# Altium schematic sheet Power Section.SchDoc
size A3; SheetNumber: 6; SheetTotal: 12
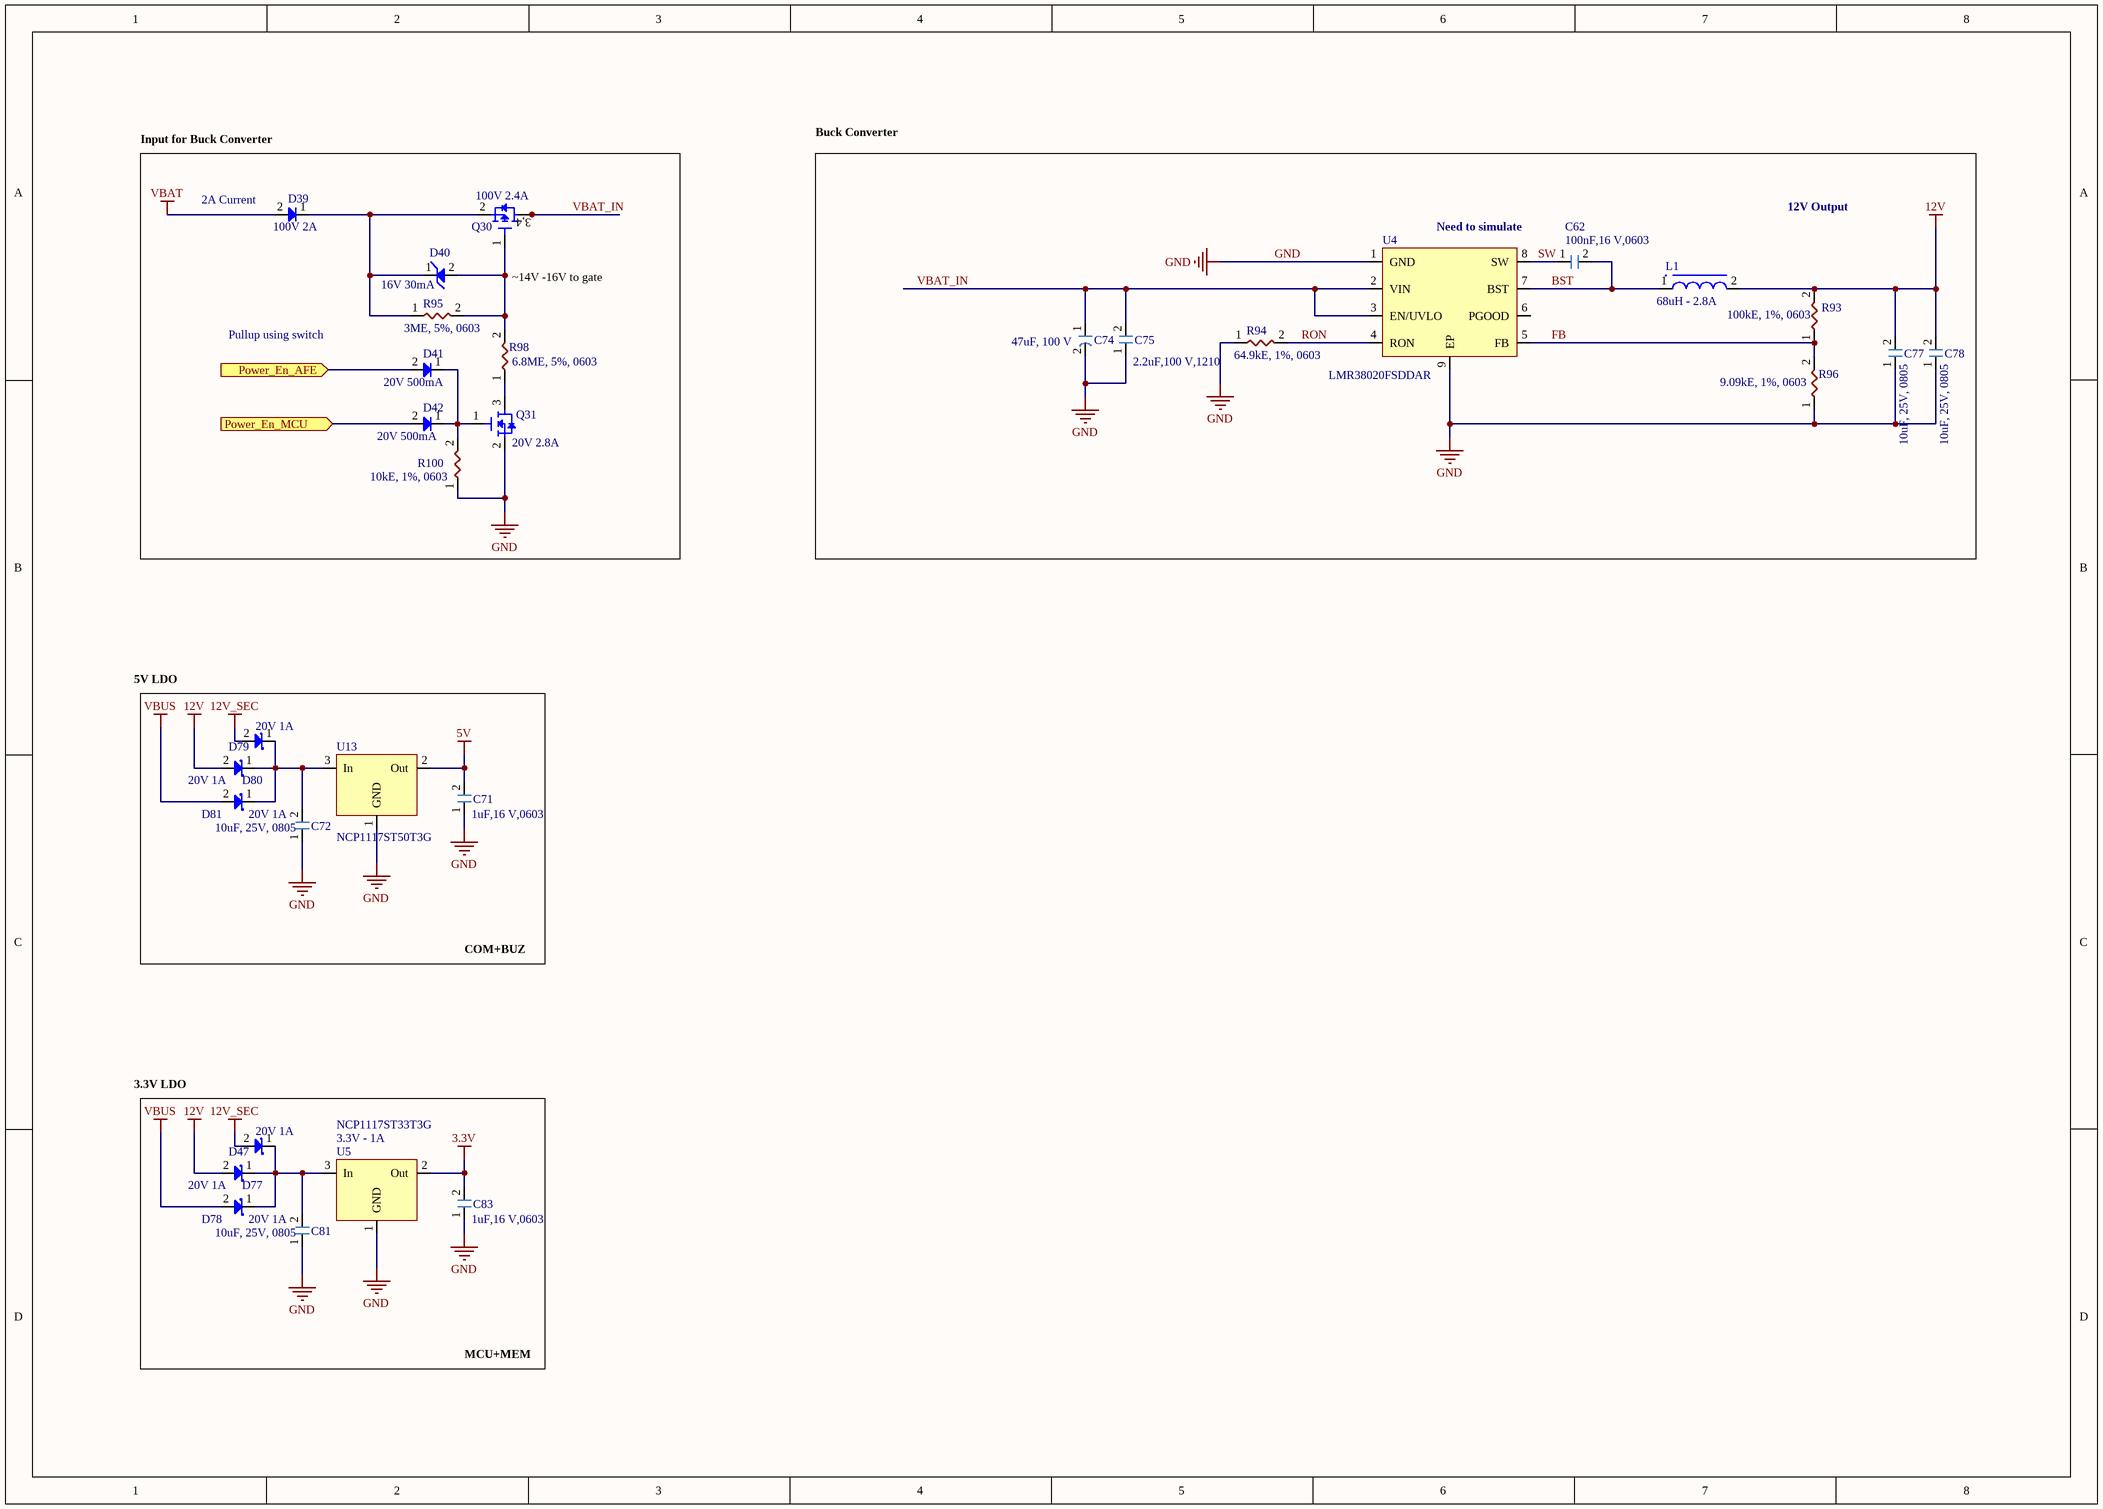
[diagram p0: Power Section.SchDoc]

## Parts
C62  Value Display: 100nF,16 V,0603  [CAPC1608X05N 0603]  (hidden comment: CC0603KRX7R7BB104)
C71  Value Display: 1uF,16 V,0603  [CAPC1608X05N 0603]  (hidden comment: CGA3E1X7R1C105K080AC)
C72  Value Display: 10uF, 25V, 0805  [CAPC2012X13N 0805]  (hidden comment: GRM21BZ71E106KE15L)
C74  Value Display: 47uF, 100 V  [Aluminium Electrolytic Capacitor]  (hidden comment: ESW476M100AH2AA)
C75  Value Display: 2.2uF,100 V,1210  [CAPC3225X28N 1210]  (hidden comment: HMK325B7225KMHT)
C77  Value Display: 10uF, 25V, 0805  [CAPC2012X13N 0805]  (hidden comment: GRM21BZ71E106KE15L)
C78  Value Display: 10uF, 25V, 0805  [CAPC2012X13N 0805]  (hidden comment: GRM21BZ71E106KE15L)
C81  Value Display: 10uF, 25V, 0805  [CAPC2012X13N 0805]  (hidden comment: GRM21BZ71E106KE15L)
C83  Value Display: 1uF,16 V,0603  [CAPC1608X05N 0603]  (hidden comment: CGA3E1X7R1C105K080AC)
D39  Value Display: 100V 2A  [SODFL350X110-2N]  (hidden comment: STPS2H100ZFY)
D40  Value Display: 16V 30mA  [DIODE_SOD123]  (hidden comment: MMSZ5246BQ-7-F)
D41  Value Display: 20V 500mA  [DIODE_SOD123]  (hidden comment: SBR80520LT1G)
D42  Value Display: 20V 500mA  [DIODE_SOD123]  (hidden comment: SBR80520LT1G)
D47  Value Display: 20V 1A  [SODFL360X98-2N]  (hidden comment: MBR120LSFT3G)
D77  Value Display: 20V 1A  [SODFL360X98-2N]  (hidden comment: MBR120LSFT3G)
D78  Value Display: 20V 1A  [SODFL360X98-2N]  (hidden comment: MBR120LSFT3G)
D79  Value Display: 20V 1A  [SODFL360X98-2N]  (hidden comment: MBR120LSFT3G)
D80  Value Display: 20V 1A  [SODFL360X98-2N]  (hidden comment: MBR120LSFT3G)
D81  Value Display: 20V 1A  [SODFL360X98-2N]  (hidden comment: MBR120LSFT3G)
L1  Value Display: 68uH - 2.8A  [INDP120120X102N]  (hidden comment: MSS1210-683ME)
Q30  Value Display: 100V 2.4A  [SOT230P700X180-4N]  (hidden comment: ZXMP10A17GQTA)
Q31  Value Display: 20V 2.8A  [SOT95P255X140-3N]  (hidden comment: DMG2302UK-7)
R93  Value Display: 100kE, 1%, 0603  [RESC1608X05N 0603]  (hidden comment: CRCW0805100KFKEA)
R94  Value Display: 64.9kE, 1%, 0603  [RESC1608X05N 0603]  (hidden comment: AC0603FR-0764K9L)
R95  Value Display: 3ME, 5%, 0603  [RESC1608X05N 0603]  (hidden comment: CRCW06033M00JNEA)
R96  Value Display: 9.09kE, 1%, 0603  [RESC1608X05N 0603]  (hidden comment: AC0603FR-079K09L)
R98  Value Display: 6.8ME, 5%, 0603  [RESC1608X05N 0603]  (hidden comment: CRCW06036M80JNEA)
R100  Value Display: 10kE, 1%, 0603  [RESC1608X05N 0603]  (hidden comment: CRCW060310K0FKEA)
U4  LMR38020FSDDAR  [SOIC127P600X170_HS-9N LM5164]
U5  NCP1117ST33T3G  Value Display: 3.3V - 1A  [SOT230P700X180-4N - NCP]
U13  NCP1117ST50T3G  [SOT230P700X180-4N - NCP]

## Blocks framed on the sheet
COM+BUZ: C71 C72 D79-D81 U13
MCU+MEM: C81 C83 D47 D77 D78 U5

## Ports
Power_En_AFE (in), Power_En_MCU (in)

## Nets
3.3V: C83.2 U5.2(Out)
5V: C71.2 U13.2(Out)
12V: C77.2 C78.2 D77.2(Anode) D80.2(Anode) L1.2 R93.2
12V_SEC: D47.2(Anode) D79.2(Anode)
GND: C71.1 C72.1 C74.2 C75.1 C77.1 C78.1 C81.1 C83.1 Q31.2(Source) R94.1 R96.1 R100.1 U4.1(GND) U4.9(EP) U5.1(GND) U13.1(GND)
VBAT: D39.2(Anode)
VBUS: D78.2(Anode) D81.2(Anode)
BST: C62.2 L1.1 U4.7(BST)
FB: R93.1 R96.2 U4.5(FB)
Power_En_AFE: D41.2(Anode) ; port Power_En_AFE
Power_En_MCU: D42.2(Anode) ; port Power_En_MCU
RON: R94.2 U4.4(RON)
SW: C62.1 U4.8(SW)
VBAT_IN: C74.1 C75.2 Q30.3(Drain) Q30.4(Drain) U4.2(VIN) U4.3(EN/UVLO)
NetC72_2: C72.2 D79.1(Cathode) D80.1(Cathode) D81.1(Cathode) U13.3(In)
NetC81_2: C81.2 D47.1(Cathode) D77.1(Cathode) D78.1(Cathode) U5.3(In)
NetD39_1: D39.1(Cathode) D40.1(Cathode) Q30.2(Source) R95.1
NetD40_2: D40.2(Anode) Q30.1(Gate) R95.2 R98.2
NetD41_1: D41.1(Cathode) D42.1(Cathode) Q31.1(Gate) R100.2
NetQ31_3: Q31.3(Drain) R98.1

Not connected (* = marked no-connect by the designer): U4 6(PGOOD)

## Notes on the sheet
- Input for Buck Converter
- Buck Converter
- (near D39) 2A Current
- (near U4) Need to simulate
- 12V Output
- (near Q30) ~14V -16V to gate
- Pullup using switch
- 5V LDO
- 3.3V LDO
- (in symbol FET_ZXMP10A17GQTA) 3,4

## Library data of the parts
C62 = Cap_CC0603KRX7R7BB104: Multilayer Ceramic Capacitor, 100 nF, 16V, ±10%,  X7R 0603 [1608 Metric]; Manufacturer: Yageo; Value: 100nF; Max Temp: 125 degC; Min Temp: -55 degC; Polarized: No; AEC-Q: NA; Manufacturer Part Number: CC0603KRX7R7BB104; Category: Capacitor; ComponentLink1Description: Datasheet; Mount Type: Surface Mount; Package: 0603; RoHS: Yes; Supplier 1: Digikey; Supplier 1 Part Number: 311-1088-1-ND; Supplier 1 pricing per Unit: 8.34 INR; Supplier: Mouser; Supplier Part Number: 603-CC603KRX7R7BB104; Supplier pricing per Unit: 8.34 INR; Technology: Ceramic; Temp Coefficient: X7R; Tolerance: 10%; Value 1: CC0603KRX7R7BB104; Voltage: 16V; ComponentLink1URL: https://www.yageo.com/upload/media/product/productsearch/datasheet/mlcc/UPY-GPHC_X7R_6.3V-to-250V_24.pdf
C71 C83 = Cap_CGA3E1X7R1C105K080AC: Multilayer Ceramic Capacitor, 1uF, 16V, ±10%,  X7R 0603 [1608 Metric]; Manufacturer: TDK Corporation; Polarized: No; AEC-Q: 200; Min Temp: -55 degC; Max Temp: 125 degC; Value: 1 uF; Manufacturer Part Number: CGA3E1X7R1C105K080AC; Package: 0603; RoHS: Yes; Mount Type: Surface Mount; Supplier 1: Digikey; Voltage: 16V; Tolerance: 10%; Technology: Ceramic; Value 1: CGA3E1X7R1C105K080AC; Category: Capacitor; ComponentLink1Description: Datasheet; ComponentLink1URL: https://product.tdk.com/system/files/dam/doc/product/capacitor/ceramic/mlcc/catalog/mlcc_automotive_general_en.pdf; Supplier 1 Part Number: 445-12539-1-ND; Supplier 1 pricing per Unit: 10.84 INR; Supplier: Mouser; Supplier Part Number: 810-CGA3E1X7R1C105AC; Supplier pricing per Unit: 10.01 INR; Temp Coefficient: X7R
C72 C77 C78 C81 = Cap_GRM21BZ71E106KE15L: Multilayer Ceramic Capacitor, 10 uF, 25V, ±10%,  X7R 0805 (2012 Metric); Manufacturer: Murata; AEC-Q: NA; Max Temp: 125 degC; Min Temp: -55 degC; Polarized: No; Value: 10 uF; Category: Capacitor; ComponentLink1Description: Datasheet; ComponentLink1URL: https://search.murata.co.jp/Ceramy/image/img/A01X/G101/ENG/GRM21BZ71E106KE15-01.pdf; Manufacturer Part Number: GRM21BZ71E106KE15L; Mount Type: Surface Mount; Package: 0805; RoHS: Yes; Supplier 1: Digikey; Supplier 1 Part Number: 490-GRM21BZ71E106KE15LCT-ND; Supplier 1 pricing per Unit: 28.51 INR; Supplier: Mouser; Supplier Part Number: 81-GRM21BZ71E106KE5L; Supplier pricing per Unit: 30.02 INR; Technology: Ceramic; Temp Coefficient: X7R; Tolerance: 10%; Value 1: GRM21BZ71E106KE15L; Voltage: 25V
C74 = Cap_ESW476M100AH2AA: Aluminum Electrolytic Capacitors Radial, 47 µF 100 V, Can 370mOhm @ 100kHz 5000 Hrs @ 105°C; Manufacturer: KEMET; AEC-Q: NA; Max Temp: 105 degC; Min Temp: -40 degC; Pitch: 5 mm; Polarized: Yes; Temp Coefficient: Electrolyte; Tolerance: 20%; Value: 47uF; Voltage: 100V; Manufacturer Part Number: ESW476M100AH2AA; Category: Capacitor; ComponentLink1Description: Datasheet; ComponentLink1URL: https://www.mouser.in/datasheet/2/447/KEM_A4009_ESW-3316312.pdf; Mount Type: TH; Package: TH; RoHS: Yes; Supplier 1: Digikey; Supplier 1 Part Number: 399-6631-ND; Supplier 1 pricing per Unit: 35.85 INR; Supplier: Mouser; Supplier Part Number: 80-ESW476M100AH2AA; Supplier pricing per Unit: 35.86 INR; Technology: Electrolyte; Value 1: ESW476M100AH2AA
C75 = Cap_HMK325B7225KMHT: Multilayer Ceramic Capacitor, 2.2 uF, 100 V, ± 10%, X7R, 1210 [3225 Metric]; Manufacturer: Taiyo Yuden; AEC-Q: 200; Max Temp: 125 degC; Min Temp: -55 degC; Polarized: No; Value: 2.2uF; Voltage: 100V; Manufacturer Part Number: HMK325B7225KMHT; Category: Capacitor; ComponentLink1Description: Datasheet; ComponentLink1URL: https://ds.yuden.co.jp/TYCOMPAS/ut/detail?pn=HMK325B7225KMHT%20%20&u=M; Mount Type: Surface Mount; Package: 1210; RoHS: Yes; Supplier 1: Digikey; Supplier 1 Part Number: 587-6142-1-ND; Supplier 1 pricing per Unit: 33.35 INR; Supplier: Mouser; Supplier Part Number: 963-HMK325B7225KMHT; Supplier pricing per Unit: 32.53 INR; Technology: Ceramic; Temp Coefficient: X7R; Tolerance: 10%; Value 1: HMK325B7225KMHT
D39 = Diode_STPS2H100ZFY: Diode 100 V 2A Surface Mount SOD-123F; Manufacturer: ST; AEC-Q: 101; Forward Voltage: 0.7V @ 2A; Max Temp: 175 degC; Min Temp: -40 degC; Value: 100V 2A; Voltage: 100V; Category: Diode; ComponentLink1Description: Datasheet; ComponentLink1URL: https://www.st.com/content/ccc/resource/technical/document/datasheet/group3/ee/fd/cc/9a/a8/bc/46/dd/DM00306086/files/DM00306086.pdf/jcr:content/translations/en.DM00306086.pdf; Forward Current: 2A; Manufacturer Part Number: STPS2H100ZFY; Mount Type: Surface Mount; Package: SOD 123; RoHS: Yes; Supplier 1: Digikey; Supplier 1 Part Number: 497-17158-1-ND; Supplier 1 pricing per Unit: 36.72 INR; Supplier: Mouser; Supplier Part Number: 511-STPS2H100ZFY; Supplier pricing per Unit: 36.70 INR; Value 1: STPS2H100ZFY
D40 = Diode_MMSZ5246BQ-7-F: Zener Diode 16 V 500 mW ±5% Surface Mount SOD-123; Manufacturer: Diodes Inc.; AEC-Q: 101; Forward Current: 30mA; Forward Voltage: 900 mV @ 10 mA; Max Temp: 150 degC; Min Temp: -65 degC; Power: 370mW; Value: 16V 30mA; Voltage: 16V; Category: Diode; ComponentLink1Description: Datasheet; ComponentLink1URL: https://www.diodes.com/assets/Datasheets/ds18010.pdf; Manufacturer Part Number: MMSZ5246BQ-7-F; Mount Type: Surface Mount; Package: SOD 123; RoHS: Yes; Supplier 1: Digikey; Supplier 1 Part Number: 31-MMSZ5246BQ-7-FTR-ND; Supplier: Mouser; Value 1: MMSZ5246BQ-7-F; Supplier 1 pricing per Unit: 17.9 INR; Supplier Part Number: 621-MMSZ5246BQ-7-F; Supplier pricing per Unit: 17.71 INR
D41 D42 = Diode_SBR80520LT1G: Diode 20 V 500mA Surface Mount SOD-123; Manufacturer: OnSemi; AEC-Q: NA; Forward Voltage: 385 mV @ 500 mA; Max Temp: 125 degC; Min Temp: -65 degC; Voltage: 20V; Category: Diode; ComponentLink1Description: Datasheet; ComponentLink1URL: https://www.onsemi.com/pdf/datasheet/mbr0520lt1-d.pdf; Forward Current: 500mA; Manufacturer Part Number: SBR80520LT1G; Mount Type: Surface Mount; Package: SOD 123; RoHS: Yes; Supplier 1: Digikey; Supplier 1 Part Number: SBR80520LT1GOSCT-ND; Supplier 1 pricing per Unit: 34.22 INR; Supplier: Mouser; Supplier Part Number: 863-SBR80520LT1G; Supplier pricing per Unit: 34.19 INR; Value 1: SBR80520LT1G; Value: 20V 500mA
D47 D77-D81 = Diode_MBR120LSFT3G: DIODE SCHOTTKY 20V 1A SOD123FL; Manufacturer: OnSemi; AEC-Q: NA; Forward Voltage: 450mV @ 1A; Max Temp: 125 degC; Min Temp: -55 degC; Value: 20V 1A; Category: Diode; ComponentLink1Description: Datasheet; ComponentLink1URL: https://www.onsemi.com/pdf/datasheet/mbr120lsft1-d.pdf; Forward Current: 1A; Manufacturer Part Number: MBR120LSFT3G; Mount Type: Surface Mount; Package: SOD 123; RoHS: Yes; Supplier 1: Digikey; Supplier 1 Part Number: MBR120LSFT3GOSCT-ND; Supplier 1 pricing per Unit: 27.69 INR; Supplier: Mouser; Supplier Part Number: 863-MBR120LSFT3G; Supplier pricing per Unit: 38.36 INR; Value 1: MBR120LSFT3G; Voltage: 20V
L1 = Ind_MSS1210-683ME: 68 µH Shielded Drum Core, Wirewound Inductor 2.8 A 80mOhm Max Nonstandard; Manufacturer: Coilcraft; Manufacturer Part Number: MSS1210-683MED; AEC-Q: 200; Max Temp: 85 degC; Min Temp: -40 degC; Value: 68uH - 2.8A; Category: Inductor; ComponentLink1Description: Datasheet; ComponentLink1URL: https://www.coilcraft.com/getmedia/f1a1bc5f-bdff-42f8-9ca8-1a0fb1d5094f/MSS1210.pdf; Mount Type: Surface Mount; Package: SMT; RoHS: Yes; Supplier 1: Digikey; Supplier 1 Part Number: 2457-MSS1210-683MED-ND; Supplier 1 pricing per Unit: 334.68 INR; Supplier: Mouser; Supplier Part Number: 994-MSS1210-683MED; Supplier pricing per Unit: 338.36 INR; Value 1: MSS1210-683MED
Q30 = FET_ZXMP10A17GQTA: P-Channel 100 V 2.4A (Ta) 2W (Ta) Surface Mount SOT-223-3; Manufacturer: Diodes Inc.; AEC-Q: 101; Forward Voltage: 100V; Max Temp: 150 degC; Min Temp: -55 degC; Rds ON: 350mΩ @ 2.4A @ -10V; Category: MOSFET; ComponentLink1Description: Datasheet; ComponentLink1URL: https://www.diodes.com/assets/Datasheets/ZXMP10A17GQ.pdf; Forward Current: 2.4A; Manufacturer Part Number: ZXMP10A17GQTA; Mount Type: Surface Mount; Package: SOT 23-3; Power: 2W; RoHS: Yes; Supplier 1: Digikey; Supplier 1 Part Number: ZXMP10A17GQTADICT-ND; Supplier 1 pricing per Unit: 85.13 INR; Supplier: Mouser; Supplier Part Number: 621-ZXMP10A17GQTA; Supplier pricing per Unit: 85.07 INR; Value 1: ZXMP10A17GQTA; Value: 100V 2.4A; Voltage: 100V; Channel: P-Channel
Q31 = FET_DMG2302UK-7: N-Channel 20 V 2.8A (Ta) 660mW (Ta) Surface Mount SOT-23-3; Manufacturer: Diodes Inc.; AEC-Q: 101; Forward Voltage: 20V; Max Temp: 150 degC; Min Temp: -55 degC; Rds ON: 90mOhms @ 3.6A, 4.5V; Manufacturer Part Number: DMG2302UK-7; Value: 20V 2.8A; RoHS: Yes; Category: MOSFET; ComponentLink1Description: Datasheet; ComponentLink1URL: https://www.diodes.com/assets/Datasheets/DMG2302UK.pdf; Forward Current: 2.8A; Mount Type: Surface Mount; Package: SOT 23-3; Power: 660mW; Supplier 1: Digikey; Supplier 1 Part Number: DMG2302UK-7DICT-ND; Supplier 1 pricing per Unit: 28.35 INR; Supplier: Mouser; Supplier Part Number: 621-DMG2302UK-7; Supplier pricing per Unit: 22.52 INR; Value 1: DMG2302UK-7; Voltage: 20V; Channel: N-Channel
R93 = Res_CRCW0603100KFKEA: SMD Chip Resistor, 100k Ohm, ± 1%, 100 mW, 0603 [1608 Metric], Thick Film, General Purpose; Manufacturer: Vishay Dale; AEC-Q: 200; Max Temp: 155 degC; Min Temp: -55 degC; Power: 1/10W; Value: 100k R; Manufacturer Part Number: CRCW0603100KFKEA; Category: Resistor; ComponentLink1Description: Datasheet; ComponentLink1URL: https://www.vishay.com/docs/20035/dcrcwe3.pdf; Mount Type: Surface Mount; Package: 0603; RoHS: Yes; Supplier 1: Digikey; Supplier 1 Part Number: 541-100KCCT-ND; Supplier 1 pricing per Unit: 8.34 INR; Supplier: Mouser; Supplier Part Number: 71-CRCW0603-100K-E3; Supplier pricing per Unit: 8.34 INR; Tolerance: 1%; Value 1: CRCW0603100KFKEA
R94 = Res_AC0603FR-0764K9L: SMD Chip Resistor,64.9k Ohms ±1% 0.1W, 1/10W, 0603 (1608 Metric) Anti-Sulfur, Automotive AEC-Q200 Thick Film; Manufacturer: Yageo; AEC-Q: 200; Max Temp: 155 degC; Min Temp: -55 degC; Value: 64.9k R; Category: Resistor; ComponentLink1Description: Datasheet; ComponentLink1URL: https://www.yageo.com/upload/media/product/productsearch/datasheet/rchip/PYu-AC_51_RoHS_L_10.pdf; Manufacturer Part Number: AC0603FR-0764K9L; Mount Type: Surface Mount; Package: 0603; Power: 1/10W; RoHS: Yes; Supplier 1: Digikey; Supplier 1 Part Number: 13-AC0603FR-0764K9LCT-ND; Supplier 1 pricing per Unit: 8.34 INR; Supplier: Mouser; Supplier Part Number: 603-AC0603FR-0764K9L; Supplier pricing per Unit: 8.34 INR; Tolerance: 1%; Value 1: AC0603FR-0764K9L
R95 = Res_CRCW06033M00JNEA: SMD Chip Resistor,3 MOhms ±5%, 1/10W, 0603 (1608 Metric) Anti-Sulfur, Automotive AEC-Q200 Thick Film; Manufacturer: Vishay Dale; AEC-Q: 200; Max Temp: 155 degC; Min Temp: -55 degC; Value: 3M R; Category: Resistor; ComponentLink1Description: Datasheet; ComponentLink1URL: https://www.vishay.com/docs/20035/dcrcwe3.pdf; Manufacturer Part Number: CRCW06033M00JNEA; Mount Type: Surface Mount; Package: 0603; Power: 1/10W; RoHS: Yes; Supplier 1: Digikey; Supplier 1 Part Number: 541-CRCW06033M00JNEACT-ND; Supplier 1 pricing per Unit: 8.34 INR; Supplier: Mouser; Supplier Part Number: 71-CRCW0603J-3M-E3; Supplier pricing per Unit: 8.34 INR; Tolerance: 5%; Value 1: CRCW06033M00JNEA
R96 = Res_AC0603FR-079K09L: SMD Chip Resistor,9.09k Ohms ±1% 0.1W, 1/10W, 0603 (1608 Metric) Anti-Sulfur, Automotive AEC-Q200 Thick Film; Manufacturer: Yageo; AEC-Q: 200; Max Temp: 155 degC; Min Temp: -55 degC; Value: 9.09k R; Category: Resistor; ComponentLink1Description: Datasheet; ComponentLink1URL: https://www.yageo.com/upload/media/product/productsearch/datasheet/rchip/PYu-AC_51_RoHS_L_10.pdf; Manufacturer Part Number: AC0603FR-079K09L; Mount Type: Surface Mount; Package: 0603; Power: 1/10W; RoHS: Yes; Supplier 1: Digikey; Supplier 1 Part Number: 13-AC0603FR-079K09LCT-ND; Supplier 1 pricing per Unit: 8.34 INR; Supplier: Mouser; Supplier Part Number: 603-AC0603FR-079K09L; Supplier pricing per Unit: 8.34 INR; Tolerance: 1%; Value 1: AC0603FR-079K09L
R98 = Res_CRCW06036M80JNEA: SMD Chip Resistor,6.8 MOhms ±5%, 1/10W, 0603 (1608 Metric) Anti-Sulfur, Automotive AEC-Q200 Thick Film; Manufacturer: Vishay Dale; AEC-Q: 200; Max Temp: 155 degC; Min Temp: -55 degC; Value: 6.8M R; Category: Resistor; ComponentLink1Description: Datasheet; ComponentLink1URL: https://www.vishay.com/docs/20035/dcrcwe3.pdf; Manufacturer Part Number: CRCW06036M80JNEA; Mount Type: Surface Mount; Package: 0603; Power: 1/10W; RoHS: Yes; Supplier 1: Digikey; Supplier 1 Part Number: 541-CRCW06036M80JNEACT-ND; Supplier 1 pricing per Unit: 8.34 INR; Supplier: Mouser; Supplier Part Number: 71-CRCW0603J-6.8M-E3; Supplier pricing per Unit: 8.34 INR; Tolerance: 5%; Value 1: CRCW06036M80JNEA
R100 = Res_CRCW060310K0FKEA: SMD Chip Resistor, 10 kOhm,±1%, 100 mW, 0603 [1608 Metric], Thick Film, General Purpose; Manufacturer: Vishay Dale; AEC-Q: 200; Max Temp: 155 degC; Min Temp: -55 degC; Power: 1/10W; Value: 10k R; Category: Resistor; ComponentLink1Description: Datasheet; ComponentLink1URL: https://www.vishay.com/docs/20035/dcrcwe3.pdf; Manufacturer Part Number: CRCW060310K0FKEA; Mount Type: Surface Mount; Package: 0603; RoHS: Yes; Supplier 1: Digikey; Supplier 1 Part Number: 541-10.0KHCT-ND; Supplier 1 pricing per Unit: 8.34 INR; Supplier: Mouser; Supplier Part Number: 71-CRCW0603-10K-E3; Supplier pricing per Unit: 8.34 INR; Tolerance: 1%; Value 1: CRCW060310K0FKEA
U4 = IC_LMR38020FSDDAR: Buck Switching Regulator IC Positive Adjustable 1V 1 Output 2A 8-PowerSOIC (0.154", 3.90mm Width); Manufacturer: Texas Instruments; AEC-Q: NA; Max Temp: 150 degC; Min Temp: -40 degC; Voltage: 4.5V - 80V; Category: Buck Converter IC; ComponentLink1Description: Datasheet; ComponentLink1URL: https://www.ti.com/lit/ds/symlink/lmr38020.pdf?ts=1730698175380&ref_url=https%253A%252F%252Fwww.ti.com%252Fproduct%252FLMR38020%253FkeyMatch%253DLMR38020%2526tisearch%253Duniversal_search; Manufacturer Part Number: LMR38020FSDDAR; Mount Type: Surface Mount; Package: DDA (SO Power PAD); RoHS: Yes; Supplier 1: Digikey; Supplier 1 Part Number: 296-LMR38020FSDDARCT-ND; Supplier 1 pricing per Unit: 207.70 INR; Supplier: Mouser; Supplier Part Number: 595-LMR38020FSDDAR; Supplier pricing per Unit: 206.00 INR; Value 1: LMR38020FSDDAR; Value: LMR38020FSDDAR; Value Display: LMR38020FSDDAR
U5 = IC_NCP1117ST33T3G: LDO Voltage Regulators 3.3V 1A Positive; Manufacturer: OnSemi; AEC-Q: NA; Max Temp: 125 degC; Min Temp: 0 degC; Value: 3.3V - 1A; Voltage: 20V (Max); Category: LDO; ComponentLink1Description: Datasheet; ComponentLink1URL: https://www.onsemi.com/pdf/datasheet/ncp1117-d.pdf; Manufacturer Part Number: NCP1117ST33T3G; Mount Type: Surface Mount; Package: SOT 22-3; RoHS: Yes; Supplier 1: Digikey; Supplier 1 Part Number: NCP1117ST33T3GOSCT-ND; Supplier 1 pricing per Unit: 93.9 INR; Supplier: Mouser; Supplier Part Number: 863-NCP1117ST33T3G; Supplier pricing per Unit: 56.71 INR; Value 1: NCP1117ST33T3G
U13 = IC_NCP1117ST50T3G: LDO Voltage Regulators 5V 1A Positive; Manufacturer: OnSemi; AEC-Q: NA; Max Temp: 125 degC; Min Temp: 0 degC; Value: 5V - 1A; Voltage: 20V (Max); Category: LDO; ComponentLink1Description: Datasheet; ComponentLink1URL: https://www.onsemi.com/pdf/datasheet/ncp1117-d.pdf; Manufacturer Part Number: NCP1117ST50T3G; Mount Type: Surface Mount; Package: SOT 22-3; RoHS: Yes; Supplier 1: Digikey; Supplier 1 Part Number: NCP1117ST50T3GOSCT-ND; Supplier 1 pricing per Unit: 94.18 INR; Supplier: Mouser; Supplier Part Number: 863-NCP1117ST50T3G; Supplier pricing per Unit: 56.71 INR; Value 1: NCP1117ST50T3G; Value Display: 5V - 1A